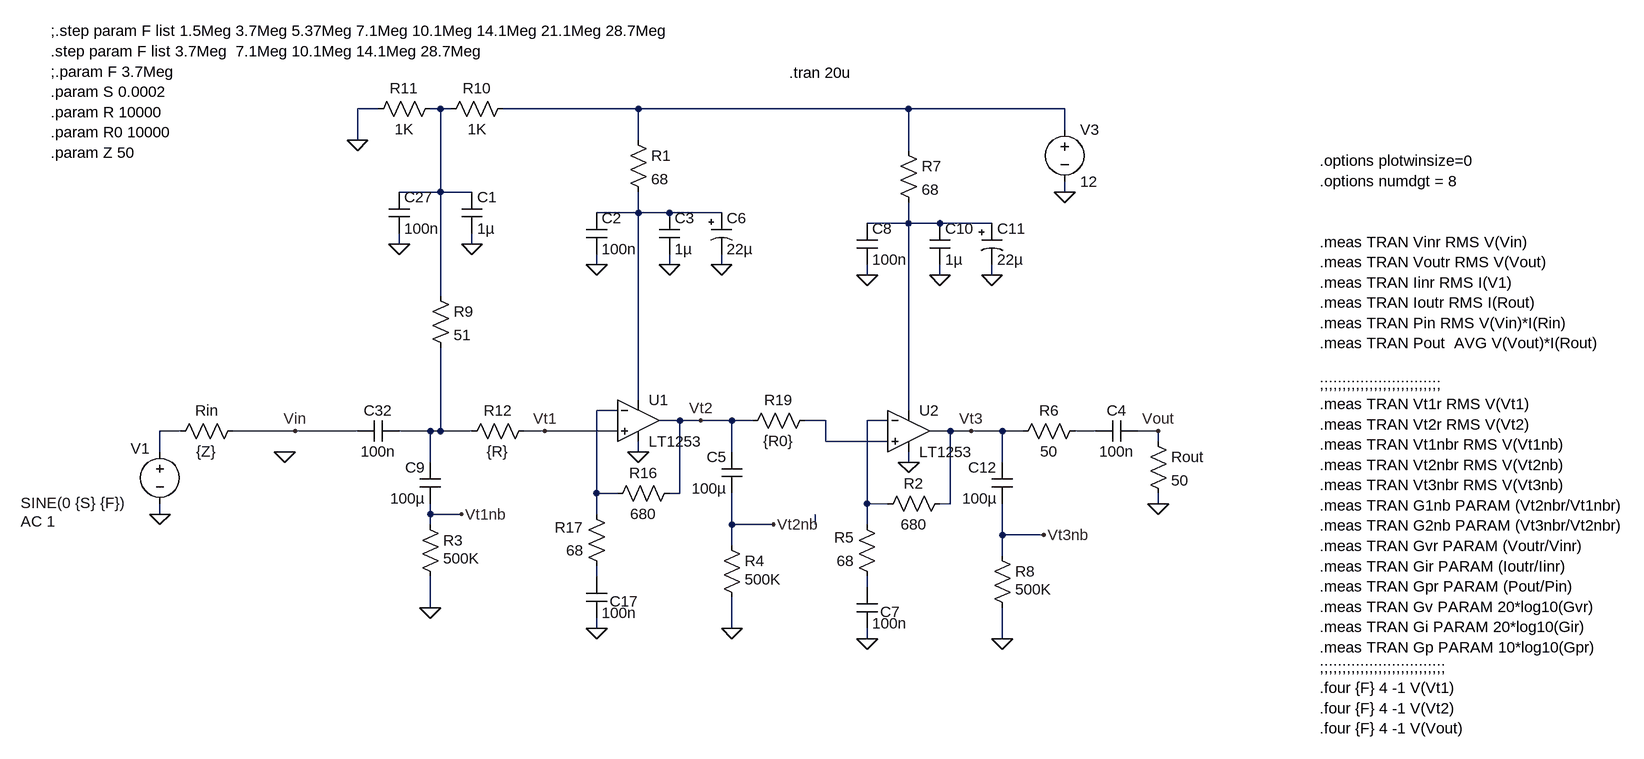
[diagram p0: schematic LT1253 Preamp.asc]
LT1253 Preamp.asc, the LTspice schematic file:
Version 4
SHEET 1 5068 2568
WIRE -592 160 -624 160
WIRE -496 160 -512 160
WIRE -480 160 -496 160
WIRE -192 160 -400 160
WIRE 224 160 -192 160
WIRE 464 160 224 160
WIRE 464 192 464 160
WIRE -624 208 -624 160
WIRE -192 208 -192 160
WIRE 224 224 224 160
WIRE -496 288 -496 160
WIRE -496 288 -560 288
WIRE -448 288 -496 288
WIRE 464 288 464 272
WIRE -192 320 -192 288
WIRE -192 320 -256 320
WIRE -144 320 -192 320
WIRE -64 320 -144 320
WIRE 224 336 224 304
WIRE 224 336 160 336
WIRE 272 336 224 336
WIRE 352 336 272 336
WIRE -560 368 -560 352
WIRE -448 368 -448 352
WIRE -256 400 -256 384
WIRE -144 400 -144 384
WIRE -64 400 -64 384
WIRE 160 416 160 400
WIRE 272 416 272 400
WIRE 352 416 352 400
WIRE -496 448 -496 288
WIRE -192 608 -192 320
WIRE -224 624 -256 624
WIRE 224 624 224 336
WIRE -128 640 -160 640
WIRE -96 640 -128 640
WIRE -48 640 -96 640
WIRE -16 640 -48 640
WIRE 96 640 64 640
WIRE 192 640 160 640
WIRE -896 656 -928 656
WIRE -720 656 -816 656
WIRE -624 656 -720 656
WIRE -512 656 -560 656
WIRE -496 656 -496 528
WIRE -496 656 -512 656
WIRE -448 656 -496 656
WIRE -336 656 -368 656
WIRE -224 656 -336 656
WIRE 288 656 256 656
WIRE 320 656 288 656
WIRE 368 656 320 656
WIRE 400 656 368 656
WIRE 512 656 480 656
WIRE 608 656 576 656
WIRE 96 672 96 640
WIRE 192 672 96 672
WIRE 608 672 608 656
WIRE -928 688 -928 656
WIRE -192 688 -192 672
WIRE -48 688 -48 640
WIRE -512 704 -512 656
WIRE 224 704 224 688
WIRE 368 704 368 656
WIRE -256 752 -256 624
WIRE -224 752 -256 752
WIRE -128 752 -128 640
WIRE -128 752 -144 752
WIRE 160 768 160 640
WIRE 192 768 160 768
WIRE 288 768 288 656
WIRE 288 768 272 768
WIRE 608 768 608 752
WIRE -928 784 -928 768
WIRE -512 784 -512 768
WIRE -464 784 -512 784
WIRE -256 784 -256 752
WIRE -512 800 -512 784
WIRE -48 800 -48 752
WIRE 16 800 -48 800
WIRE 80 800 80 784
WIRE 160 800 160 768
WIRE 368 816 368 768
WIRE 432 816 368 816
WIRE -48 832 -48 800
WIRE 368 848 368 816
WIRE -256 880 -256 864
WIRE 160 896 160 880
WIRE -512 928 -512 880
WIRE -256 960 -256 944
WIRE -48 960 -48 912
WIRE 160 976 160 960
WIRE 368 976 368 928
FLAG -928 784 0
FLAG 608 656 Vout
FLAG 608 768 0
FLAG -720 656 Vin
FLAG -736 688 0
FLAG 464 288 0
FLAG -560 368 0
FLAG -192 688 0
FLAG -624 208 0
FLAG -256 960 0
FLAG -336 656 Vt1
FLAG -96 640 Vt2
FLAG -448 368 0
FLAG -256 400 0
FLAG -144 400 0
FLAG -64 400 0
FLAG -512 928 0
FLAG -464 784 Vt1nb
FLAG -48 960 0
FLAG 16 800 Vt2nb
FLAG 224 704 0
FLAG 160 976 0
FLAG 320 656 Vt3
FLAG 160 416 0
FLAG 272 416 0
FLAG 352 416 0
FLAG 368 976 0
FLAG 432 816 Vt3nb
SYMBOL voltage -928 672 R0
WINDOW 0 -45 11 Left 2
WINDOW 3 -214 95 Left 2
WINDOW 123 -214 123 Left 2
WINDOW 39 -214 151 Left 2
SYMATTR InstName V1
SYMATTR Value SINE(0 {S} {F})
SYMATTR Value2 AC 1
SYMBOL res 592 656 R0
SYMATTR InstName Rout
SYMATTR Value 50
SYMBOL voltage 464 176 R0
WINDOW 123 0 0 Left 2
WINDOW 39 0 0 Left 2
SYMATTR InstName V3
SYMATTR Value 12
SYMBOL Opamps\\LT1253 -192 576 R0
SYMATTR InstName U1
SYMBOL res -512 432 R0
SYMATTR InstName R9
SYMATTR Value 51
SYMBOL res -384 144 R90
WINDOW 0 0 56 VBottom 2
WINDOW 3 32 56 VTop 2
SYMATTR InstName R10
SYMATTR Value 1K
SYMBOL res -496 144 R90
WINDOW 0 0 56 VBottom 2
WINDOW 3 32 56 VTop 2
SYMATTR InstName R11
SYMATTR Value 1K
SYMBOL res -352 640 R90
WINDOW 0 0 56 VBottom 2
WINDOW 3 32 56 VTop 2
SYMATTR InstName R12
SYMATTR Value {R}
SYMBOL res -128 736 R90
WINDOW 0 0 56 VBottom 2
WINDOW 3 32 56 VTop 2
SYMATTR InstName R16
SYMATTR Value 680
SYMBOL res -240 880 R180
WINDOW 0 36 76 Left 2
WINDOW 3 36 40 Left 2
SYMATTR InstName R17
SYMATTR Value 68
SYMBOL cap -272 880 R0
WINDOW 0 36 38 Left 2
SYMATTR InstName C17
SYMATTR Value 100n
SYMBOL cap -576 288 R0
SYMATTR InstName C27
SYMATTR Value 100n
SYMBOL cap -560 640 R90
WINDOW 0 0 32 VBottom 2
WINDOW 3 32 32 VTop 2
SYMATTR InstName C32
SYMATTR Value 100n
SYMBOL res 80 624 R90
WINDOW 0 0 56 VBottom 2
WINDOW 3 32 56 VTop 2
SYMATTR InstName R19
SYMATTR Value {R0}
SYMBOL cap -464 288 R0
SYMATTR InstName C1
SYMATTR Value 1µ
SYMBOL res -208 192 R0
SYMATTR InstName R1
SYMATTR Value 68
SYMBOL cap -272 320 R0
SYMATTR InstName C2
SYMATTR Value 100n
SYMBOL cap -160 320 R0
SYMATTR InstName C3
SYMATTR Value 1µ
SYMBOL polcap -80 320 R0
WINDOW 3 24 56 Left 2
SYMATTR Value 22µ
SYMATTR InstName C6
SYMATTR Description Capacitor
SYMATTR Type cap
SYMATTR SpiceLine V=25 Irms=60m Rser=2.4 Lser=0 mfg="Nichicon" pn="UPR1E220MAH" type="Al electrolytic"
SYMBOL res -800 640 R90
WINDOW 0 0 56 VBottom 2
WINDOW 3 32 56 VTop 2
SYMATTR InstName Rin
SYMATTR Value {Z}
SYMBOL cap -496 768 R180
WINDOW 0 24 56 Left 2
WINDOW 3 24 8 Left 2
SYMATTR InstName C9
SYMATTR Value 100µ
SYMBOL res -528 784 R0
WINDOW 3 36 68 Left 2
SYMATTR Value 500K
SYMATTR InstName R3
SYMBOL cap 576 640 R90
WINDOW 0 0 32 VBottom 2
WINDOW 3 32 32 VTop 2
SYMATTR InstName C4
SYMATTR Value 100n
SYMBOL cap -32 752 R180
WINDOW 0 24 56 Left 2
WINDOW 3 24 8 Left 2
SYMATTR InstName C5
SYMATTR Value 100µ
SYMBOL res -64 816 R0
WINDOW 3 36 68 Left 2
SYMATTR Value 500K
SYMATTR InstName R4
SYMBOL Opamps\\LT1253 224 592 R0
SYMATTR InstName U2
SYMBOL res 288 752 R90
WINDOW 0 0 56 VBottom 2
WINDOW 3 32 56 VTop 2
SYMATTR InstName R2
SYMATTR Value 680
SYMBOL res 176 896 R180
WINDOW 0 36 76 Left 2
WINDOW 3 36 40 Left 2
SYMATTR InstName R5
SYMATTR Value 68
SYMBOL cap 144 896 R0
WINDOW 0 36 38 Left 2
SYMATTR InstName C7
SYMATTR Value 100n
SYMBOL res 496 640 R90
WINDOW 0 0 56 VBottom 2
WINDOW 3 32 56 VTop 2
SYMATTR InstName R6
SYMATTR Value 50
SYMBOL res 208 208 R0
SYMATTR InstName R7
SYMATTR Value 68
SYMBOL cap 144 336 R0
SYMATTR InstName C8
SYMATTR Value 100n
SYMBOL cap 256 336 R0
SYMATTR InstName C10
SYMATTR Value 1µ
SYMBOL polcap 336 336 R0
WINDOW 3 24 56 Left 2
SYMATTR Value 22µ
SYMATTR InstName C11
SYMATTR Description Capacitor
SYMATTR Type cap
SYMATTR SpiceLine V=25 Irms=60m Rser=2.4 Lser=0 mfg="Nichicon" pn="UPR1E220MAH" type="Al electrolytic"
SYMBOL cap 384 768 R180
WINDOW 0 24 56 Left 2
WINDOW 3 24 8 Left 2
SYMATTR InstName C12
SYMATTR Value 100µ
SYMBOL res 352 832 R0
WINDOW 3 36 68 Left 2
SYMATTR Value 500K
SYMATTR InstName R8
TEXT 856 240 Left 2 !.options plotwinsize=0\n.options numdgt = 8\n \n \n.meas TRAN Vinr RMS V(Vin)\n.meas TRAN Voutr RMS V(Vout)\n.meas TRAN Iinr RMS I(V1)\n.meas TRAN Ioutr RMS I(Rout)\n.meas TRAN Pin RMS V(Vin)*I(Rin)\n.meas TRAN Pout  AVG V(Vout)*I(Rout)\n \n;;;;;;;;;;;;;;;;;;;;;;;;;;;\n.meas TRAN Vt1r RMS V(Vt1)\n.meas TRAN Vt2r RMS V(Vt2)\n.meas TRAN Vt1nbr RMS V(Vt1nb)\n.meas TRAN Vt2nbr RMS V(Vt2nb)\n.meas TRAN Vt3nbr RMS V(Vt3nb)\n.meas TRAN G1nb PARAM (Vt2nbr/Vt1nbr)\n.meas TRAN G2nb PARAM (Vt3nbr/Vt2nbr)\n.meas TRAN Gvr PARAM (Voutr/Vinr)\n.meas TRAN Gir PARAM (Ioutr/Iinr)\n.meas TRAN Gpr PARAM (Pout/Pin)\n.meas TRAN Gv PARAM 20*log10(Gvr)\n.meas TRAN Gi PARAM 20*log10(Gir)\n.meas TRAN Gp PARAM 10*log10(Gpr)\n;;;;;;;;;;;;;;;;;;;;;;;;;;;;\n.four {F} 4 -1 V(Vt1)\n.four {F} 4 -1 V(Vt2)\n.four {F} 4 -1 V(Vout)
TEXT 40 104 Left 2 !.tran 20u
TEXT -1096 40 Left 2 !;.step param F list 1.5Meg 3.7Meg 5.37Meg 7.1Meg 10.1Meg 14.1Meg 21.1Meg 28.7Meg\n.step param F list 3.7Meg  7.1Meg 10.1Meg 14.1Meg 28.7Meg\n;.param F 3.7Meg\n.param S 0.0002\n.param R 10000 \n.param R0 10000 \n.param Z 50

The netlist it stands for:
* LT1253 Preamp.asc
V1 N008 0 SINE(0 {S} {F}) AC 1
Rout Vout 0 50
V3 N002 0 12
XU1 Vt1 N005 N003 0 Vt2 LT1253  ; pins In+ In- V+ V- OUT
R9 N001 N009 51
R10 N002 N001 1K
R11 N001 0 1K
R12 Vt1 N009 {R}
R16 Vt2 N005 680
R17 N012 N005 68
C17 N012 0 100n
C27 N001 0 100n
C32 N009 Vin 100n
R19 N006 Vt2 {R0}
C1 N001 0 1µ
R1 N002 N003 68
C2 N003 0 100n
C3 N003 0 1µ
C6 N003 0 22µ V=25 Irms=60m Rser=2.4 Lser=0 mfg="Nichicon" pn="UPR1E220MAH" type="Al electrolytic"
Rin Vin N008 {Z}
C9 Vt1nb N009 100µ
R3 Vt1nb 0 500K
C4 Vout N010 100n
C5 Vt2nb Vt2 100µ
R4 Vt2nb 0 500K
XU2 N006 N007 N004 0 Vt3 LT1253  ; pins In+ In- V+ V- OUT
R2 Vt3 N007 680
R5 N013 N007 68
C7 N013 0 100n
R6 N010 Vt3 50
R7 N002 N004 68
C8 N004 0 100n
C10 N004 0 1µ
C11 N004 0 22µ V=25 Irms=60m Rser=2.4 Lser=0 mfg="Nichicon" pn="UPR1E220MAH" type="Al electrolytic"
C12 Vt3nb Vt3 100µ
R8 Vt3nb 0 500K
.options plotwinsize=0
.options numdgt = 8
.meas TRAN Vinr RMS V(Vin)
.meas TRAN Voutr RMS V(Vout)
.meas TRAN Iinr RMS I(V1)
.meas TRAN Ioutr RMS I(Rout)
.meas TRAN Pin RMS V(Vin)*I(Rin)
.meas TRAN Pout  AVG V(Vout)*I(Rout)
;;;;;;;;;;;;;;;;;;;;;;;;;;;
.meas TRAN Vt1r RMS V(Vt1)
.meas TRAN Vt2r RMS V(Vt2)
.meas TRAN Vt1nbr RMS V(Vt1nb)
.meas TRAN Vt2nbr RMS V(Vt2nb)
.meas TRAN Vt3nbr RMS V(Vt3nb)
.meas TRAN G1nb PARAM (Vt2nbr/Vt1nbr)
.meas TRAN G2nb PARAM (Vt3nbr/Vt2nbr)
.meas TRAN Gvr PARAM (Voutr/Vinr)
.meas TRAN Gir PARAM (Ioutr/Iinr)
.meas TRAN Gpr PARAM (Pout/Pin)
.meas TRAN Gv PARAM 20*log10(Gvr)
.meas TRAN Gi PARAM 20*log10(Gir)
.meas TRAN Gp PARAM 10*log10(Gpr)
;;;;;;;;;;;;;;;;;;;;;;;;;;;;
.four {F} 4 -1 V(Vt1)
.four {F} 4 -1 V(Vt2)
.four {F} 4 -1 V(Vout)
.tran 20u
;.step param F list 1.5Meg 3.7Meg 5.37Meg 7.1Meg 10.1Meg 14.1Meg 21.1Meg 28.7Meg
.step param F list 3.7Meg  7.1Meg 10.1Meg 14.1Meg 28.7Meg
;.param F 3.7Meg
.param S 0.0002
.param R 10000
.param R0 10000
.param Z 50
.backanno
.end